# Altium schematic sheet 07_RS485.SchDoc
size A4; Revision: A
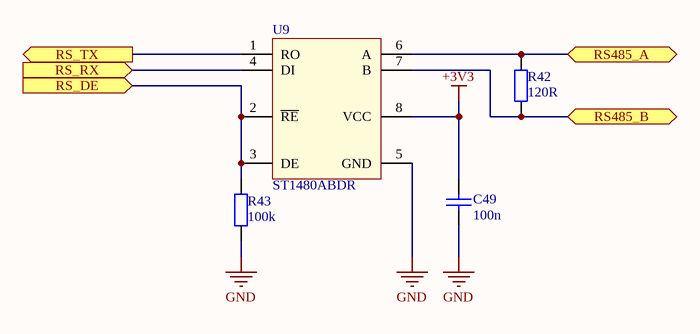
[diagram p0: 07_RS485.SchDoc]

## Parts
C49  100n  [C0603_IPC_HD]
R42  120R  [R0603_IPC_MD]
R43  100k  [R0603_IPC_MD]
U9  ST1480ABDR  [SOIC-8]

## Ports
RS485_A (bidir), RS485_B (bidir), RS_DE (in), RS_RX (in), RS_TX (out)

## Nets
+3V3: C49.2 U9.8(VCC)
GND: C49.1 R43.1 U9.5(GND)
RS485_A: R42.2 U9.6(A) ; port RS485_A
RS485_B: R42.1 U9.7(B) ; port RS485_B
RS_DE: R43.2 U9.2(~{RE}) U9.3(DE) ; port RS_DE
RS_RX: U9.4(DI) ; port RS_RX
RS_TX: U9.1(RO) ; port RS_TX

## Notes on the sheet
- Title
- Size:
- Date:
- A4
- Number:
- Time:
- Revision:
- Sheet
- of
- File:

## Library data of the parts
C49 = CL10B104KO8NNNC: CAP CER 0.1UF 16V X7R 0603; Manufacturer: Samsung Electro-Mechanics; Manufacturer Part Number: CL10B104KO8NNNC; Voltage: 16V; Value: 100n; Dielectric: X7R; Supplier 1: Digi-Key; Supplier Part Number 1: 1276-1005-1-ND
R42 = RC0603JR-07120RL: RES SMD 120 OHM 5% 1/10W 0603; Manufacturer: Yageo; Value: 120R; Tolarance: 5%; Manufacturer Part Number: RC0603JR-07120RL; Supplier 1: Digi-Key; Supplier Part Number 1: 311-120GRCT-ND
R43 = RMCF0603FT100K: RES 100K OHM 1% 1/10W 0603; Manufacturer: Bourns Inc.; Value: 100k; Tolarance: 1%; Manufacturer Part Number: RMCF0603FT100K; Supplier 1: Digi-Key; Supplier Part Number 1: RMCF0603FT100KCT-ND
U9 = ST1480ABDR: IC TXRX 3.3V RS485/422 8 SOIC; Manufacturer: STMicroelectronics; Manufacturer Part Number: ST1480ABDR; Supplier 1: Digi-Key; Supplier Part Number 1: 497-2046-1-ND